# Altium project AudioDC-DIFF.PrjPcb
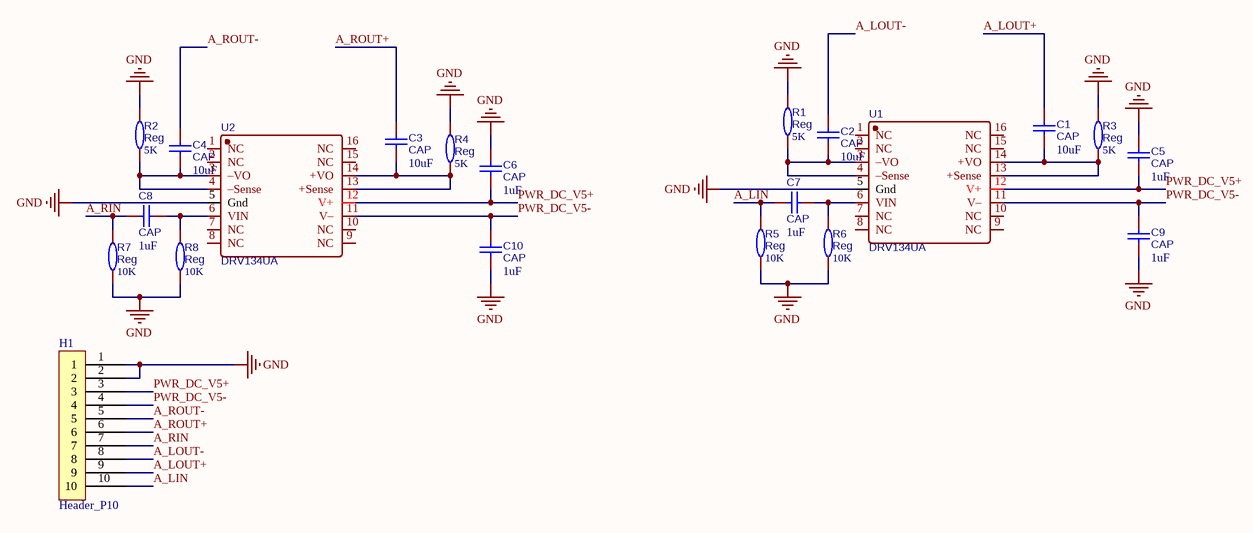
[diagram p0: DC-DIFF-Convertor.SchDoc]
2 sheets, 29 parts. Net scope: global (net labels, ports and power ports of the same name join across sheets).
Board file: DIFF_TFT.PcbDoc
Sheets:
  DC-DIFF-Convertor.SchDoc
  TFT.SchDoc

## Sheet DC-DIFF-Convertor.SchDoc
size A4; Organization: Altium Limited; Address1: L3, 12a Rodborough Rd; Address2: Frenchs Forest; Address3: NSW; Address4: Australia 2086

### Parts
C1  CAP  value 10uF  [C0603]
C2  CAP  value 10uF  [C0603]
C3  CAP  value 10uF  [C0603]
C4  CAP  value 10uF  [C0603]
C5  CAP  value 1uF  [C0603]
C6  CAP  value 1uF  [C0603]
C7  CAP  value 1uF  [C0603]
C8  CAP  value 1uF  [C0603]
C9  CAP  value 1uF  [C0603]
C10  CAP  value 1uF  [C0603]
H1  Header_P10  [H_2.54_P10]
R1  Reg  value 5K  [R0603]
R2  Reg  value 5K  [R0603]
R3  Reg  value 5K  [R0603]
R4  Reg  value 5K  [R0603]
R5  Reg  value 10K  [R0603]
R6  Reg  value 10K  [R0603]
R7  Reg  value 10K  [R0603]
R8  Reg  value 10K  [R0603]
U1  DRV134UA  [SOIC-16_9.5mm]
U2  DRV134UA  [SOIC-16_9.5mm]

### Nets
GND: C5.2 C6.2 C9.1 C10.1 H1.1 H1.2 R1.2 R2.2 R3.1 R4.1 R5.1 R6.1 R7.1 R8.1 U1.5(Gnd) U2.5(Gnd)
A_LIN: C7.1 H1.10 R5.2
A_LOUT+: C1.2 H1.9
A_LOUT-: C2.2 H1.8
A_RIN: C8.1 H1.7 R7.2
A_ROUT+: C3.2 H1.6
A_ROUT-: C4.2 H1.5
PWR_DC_V5+: C5.1 C6.1 H1.3 U1.12(V+) U2.12(V+)
PWR_DC_V5-: C9.2 C10.2 H1.4 U1.11(V–) U2.11(V–)
NetC1_1: C1.1 R3.2 U1.13(+Sense) U1.14(+VO)
NetC2_1: C2.1 R1.1 U1.3(–VO) U1.4(–Sense)
NetC3_1: C3.1 R4.2 U2.13(+Sense) U2.14(+VO)
NetC4_1: C4.1 R2.1 U2.3(–VO) U2.4(–Sense)
NetC7_2: C7.2 R6.2 U1.6(VIN)
NetC8_2: C8.2 R8.2 U2.6(VIN)

Not connected (* = marked no-connect by the designer): U1 1(NC) 2(NC) 7(NC) 8(NC) 9(NC) 10(NC) 15(NC) 16(NC); U2 1(NC) 2(NC) 7(NC) 8(NC) 9(NC) 10(NC) 15(NC) 16(NC)

### Notes on the sheet
- Title
- Size:
- Date:
- A4
- Number:
- Time:
- Revision:
- Sheet
- of
- File:

### Library data of the parts
C1-C10 = CAP: BOM_Manufacturer: Huaxin S&T; BOM_Manufacturer Part: 0603B103K101CT; nameAlias: Capacitance; Contributor: LCSC; BOM_Supplier: LCSC; BOM_Supplier Part: C302008; spicePre: C; spiceSymbolName: 0603B103K101CT
H1 = Header_P10: Header 10Pin
R1-R8 = Res: 电阻; BOM_Manufacturer: Viking Tech; BOM_Manufacturer Part: AR03BTCX1002A; nameAlias: Resistance (Ohms); Contributor: LCSC; BOM_Supplier: LCSC; BOM_Supplier Part: C465721; spicePre: R; spiceSymbolName: AR03BTCX1002A
U1 U2 = DRV134UA: 音频差分放大器; BOM_Manufacturer: TI(德州仪器); Contributor: LCSC; BOM_Supplier: LCSC; BOM_Supplier Part: C1519988; BOM_Manufacturer Part: DRV134UA; BOM_JLCPCB Part Class: Extended Part; spicePre: U; spiceSymbolName: DRV134UA

## Sheet TFT.SchDoc
size A4; Organization: Altium Limited; Address1: L3, 12a Rodborough Rd; Address2: Frenchs Forest; Address3: NSW; Address4: Australia 2086
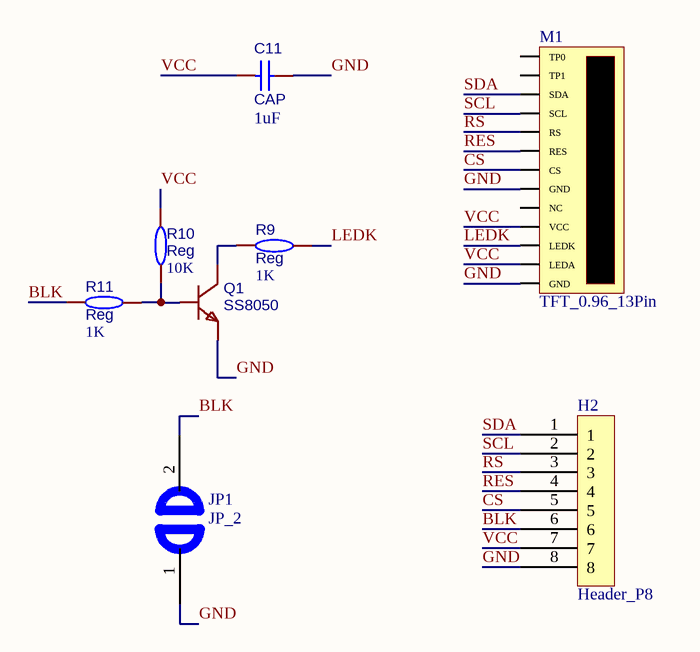
[diagram p1: TFT.SchDoc]

### Parts
C11  CAP  value 1uF  [C0603]
H2  Header_P8  [H_2.54_P8]
JP1  JP_2  [JP_2Pin]
M1  TFT_0.96_13Pin  [TFT_0.96_13Pin]
Q1  SS8050  [SOT-23-3]
R9  Reg  value 1K  [R0603]
R10  Reg  value 10K  [R0603]
R11  Reg  value 1K  [R0603]

### Nets
GND: C11.2 H2.8 JP1.1 M1.8(GND) M1.13(GND) Q1.2(E)
BLK: H2.6 JP1.2 R11.1
CS: H2.5 M1.7(CS)
LEDK: M1.11(LEDK) R9.2
RES: H2.4 M1.6(RES)
RS: H2.3 M1.5(RS)
SCL: H2.2 M1.4(SCL)
SDA: H2.1 M1.3(SDA)
VCC: C11.1 H2.7 M1.10(VCC) M1.12(LEDA) R10.2
NetQ1_1: Q1.1(B) R10.1 R11.2
NetQ1_3: Q1.3(C) R9.1

Not connected (* = marked no-connect by the designer): M1 1(TP0) 2(TP1) 9(NC)

### Notes on the sheet
- Title
- Size:
- Date:
- A4
- Number:
- Time:
- Revision:
- Sheet
- of
- File:

### Library data of the parts
C11 = CAP: as C1 on sheet DC-DIFF-Convertor; BOM_Supplier: LCSC; BOM_Supplier Part: C302008; spicePre: C; spiceSymbolName: 0603B103K101CT
H2 = Header_P8: 8Pin排针
JP1 = JP_2: 2Pin跳线焊盘
M1 = TFT_0.96_13Pin: ST7735_TFT
Q1 = SS8050: NPN; BOM_Manufacturer: AnBon; Contributor: LCSC; BOM_Paste Type: recommend; BOM_Supplier: LCSC; BOM_Supplier Part: C541705; BOM_Manufacturer Part: SS8050; spicePre: Q; spiceSymbolName: SS8050_C541705
R9-R11 = Res: as R1 on sheet DC-DIFF-Convertor; BOM_Supplier: LCSC; BOM_Supplier Part: C465721; spicePre: R; spiceSymbolName: AR03BTCX1002A

## Nets that join several sheets
GND: DC-DIFF-Convertor (16 pins), TFT (6 pins)